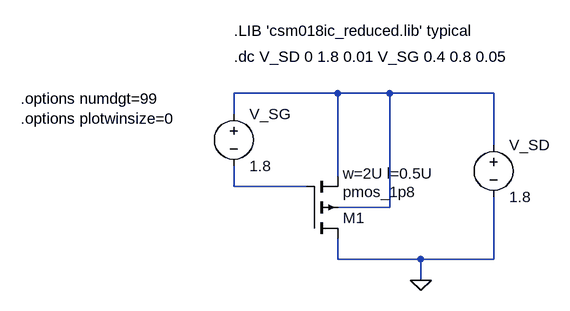
[diagram p0: schematic pmos_id_vsd.asc]
pmos_id_vsd.asc, the LTspice schematic file:
Version 4
SHEET 1 880 680
WIRE 160 192 0 192
WIRE 240 192 160 192
WIRE 400 192 240 192
WIRE 0 224 0 192
WIRE 400 272 400 192
WIRE 160 320 160 192
WIRE 0 336 0 304
WIRE 112 336 0 336
WIRE 240 368 240 192
WIRE 240 368 160 368
WIRE 160 448 160 416
WIRE 288 448 160 448
WIRE 400 448 400 352
WIRE 400 448 288 448
WIRE 288 480 288 448
FLAG 288 480 0
SYMBOL voltage 0 208 R0
WINDOW 123 0 0 Left 0
WINDOW 39 0 0 Left 0
SYMATTR InstName V_SG
SYMATTR Value 1.8
SYMBOL voltage 400 256 R0
WINDOW 123 0 0 Left 0
WINDOW 39 0 0 Left 0
SYMATTR InstName V_SD
SYMATTR Value 1.8
SYMBOL pmos4 112 416 M180
WINDOW 123 56 100 Left 2
SYMATTR Value2 w=2U l=0.5U
SYMATTR InstName M1
SYMATTR Value pmos_1p8
TEXT 0 96 Left 2 !.LIB 'csm018ic_reduced.lib' typical
TEXT 0 136 Left 2 !.dc V_SD 0 1.8 0.01 V_SG 0.4 0.8 0.05
TEXT -328 200 Left 2 !.options numdgt=99\n.options plotwinsize=0

The netlist it stands for:
* pmos_id_vsd.asc
V_SG N001 N002 1.8
V_SD N001 0 1.8
M1 0 N002 N001 N001 pmos_1p8 w=2U l=0.5U
.model NMOS NMOS
.model PMOS PMOS
.lib standard.mos
.LIB 'csm018ic_reduced.lib' typical
.dc V_SD 0 1.8 0.01 V_SG 0.4 0.8 0.05
.options numdgt=99
.options plotwinsize=0
.backanno
.end